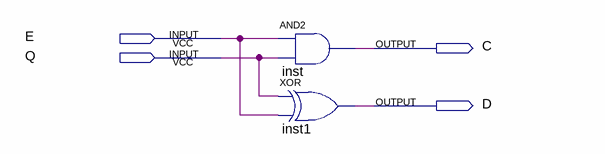
[diagram p0: schematic sheet]
// Quartus schematic HA.bdf as structural Verilog: 2 symbols, 4 pins
module HA (
  input  E,
  input  Q,
  output C,
  output D
);

  and inst (C, E, Q);
  xor inst1 (D, Q, E);
endmodule
